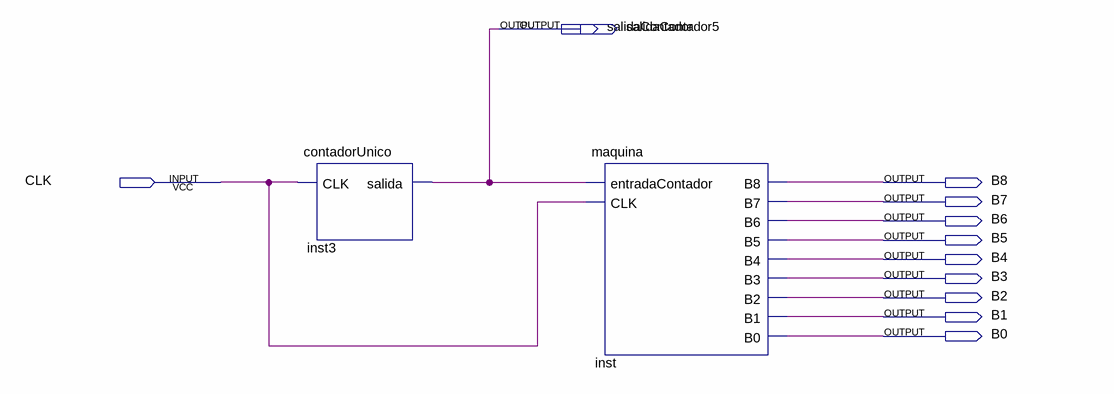
[diagram p0: schematic sheet]
// Quartus schematic DiagramaPrincipal.bdf as structural Verilog: 2 symbols, 12 pins
module DiagramaPrincipal (
  input  CLK,
  output salidaContador,
  output salidaContador5,
  output B8,
  output B7,
  output B6,
  output B5,
  output B4,
  output B3,
  output B2,
  output B1,
  output B0
);

  contadorUnico inst3 (.CLK(CLK), .salida(salidaContador));
  maquina inst (
    .entradaContador(salidaContador), .CLK(CLK), .B8(B8), .B7(B7), .B6(B6), .B5(B5), .B4(B4), .B3(B3),
    .B2(B2), .B1(B1), .B0(B0));
endmodule
